# EAGLE schematic Test (EAGLE 7.3.0)
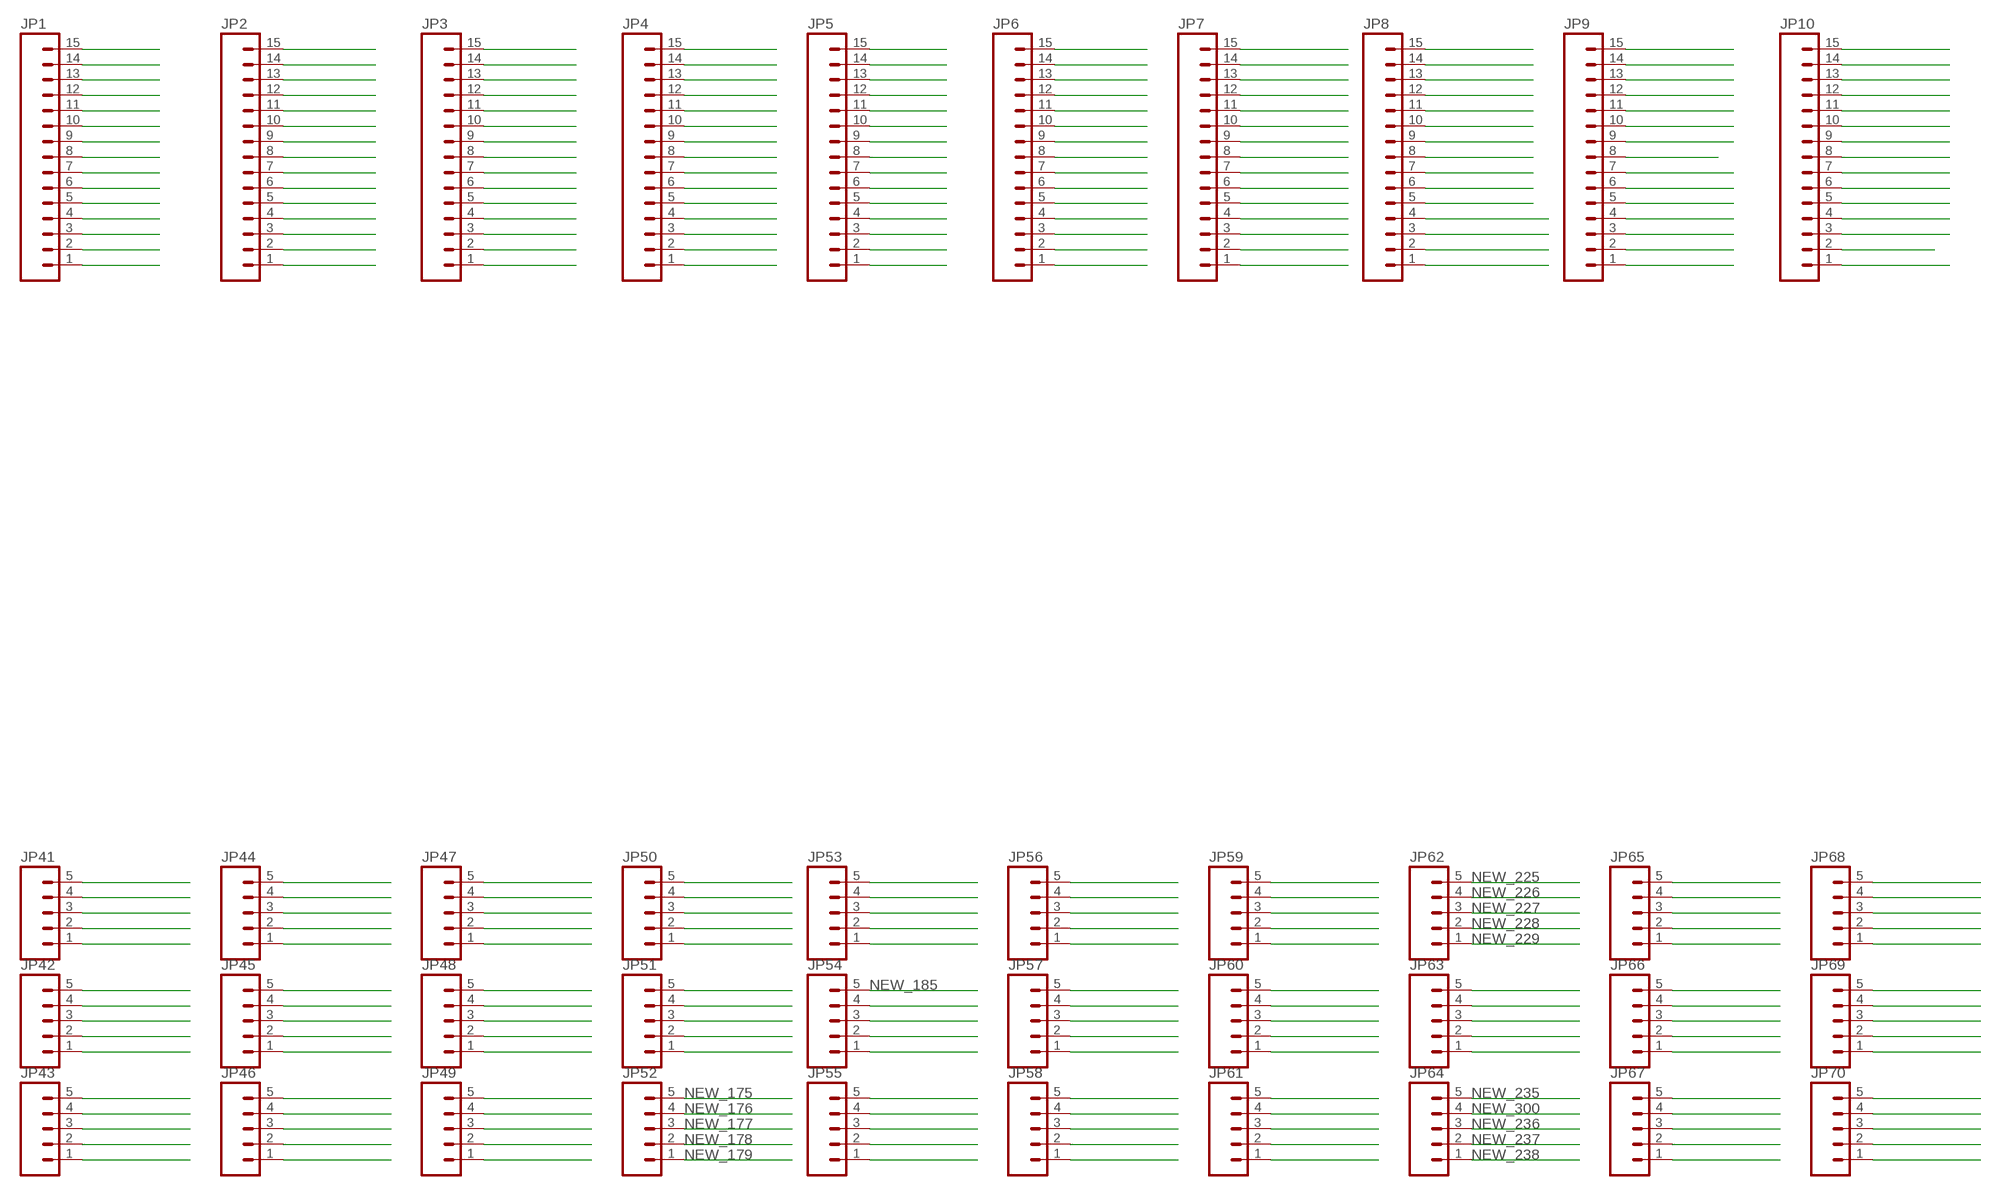
[diagram p0: schematic, sheet 1, part 1 of 2]
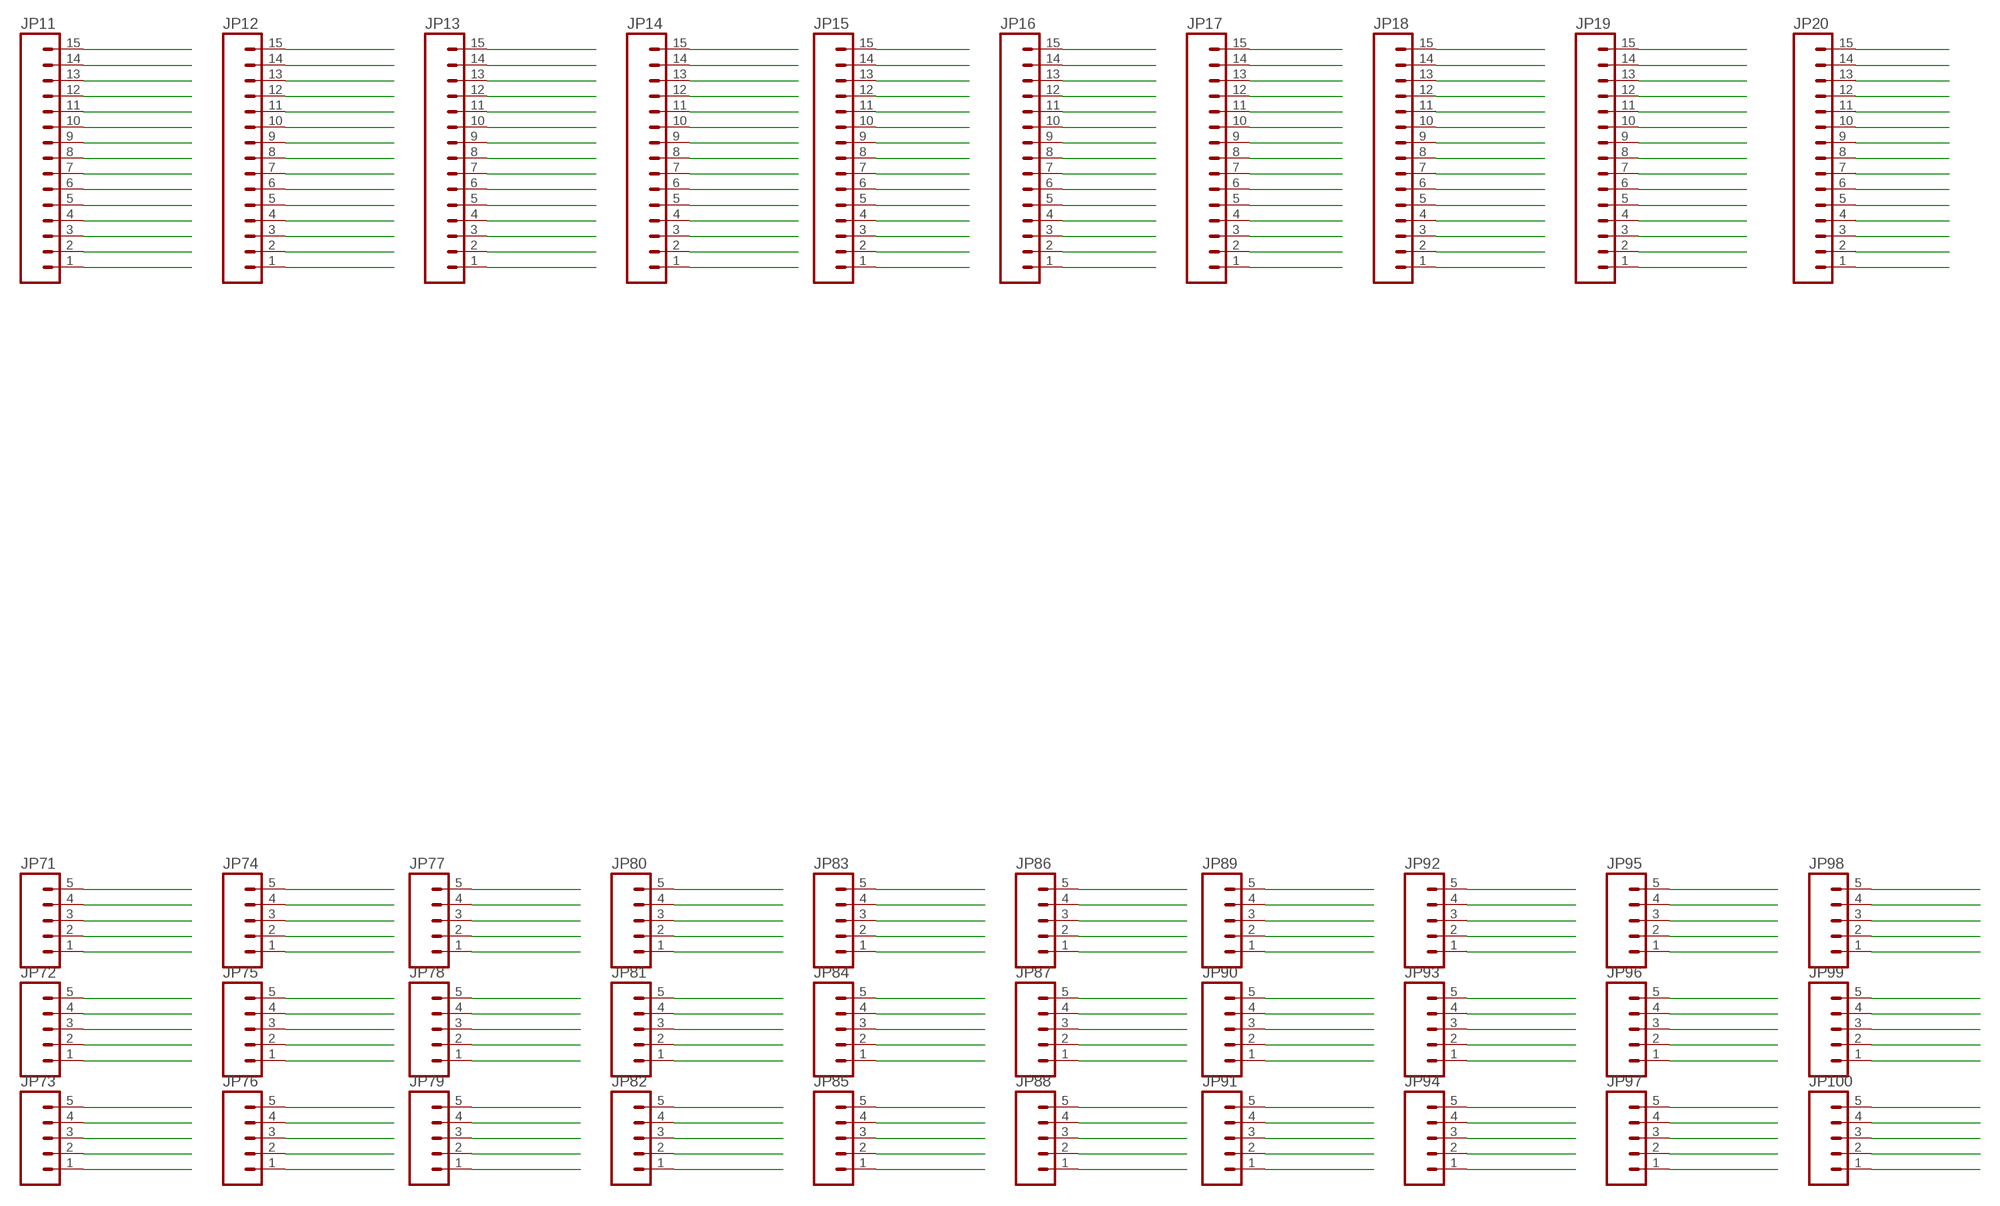
[diagram p1: schematic, sheet 1, part 2 of 2]

## Parts
JP1  M15  [1X15]
JP2  M15  [1X15]
JP3  M15  [1X15]
JP4  M15  [1X15]
JP5  M15  [1X15]
JP6  M15  [1X15]
JP7  M15  [1X15]
JP8  M15  [1X15]
JP9  M15  [1X15]
JP10  M15  [1X15]
JP11  M15  [1X15]
JP12  M15  [1X15]
JP13  M15  [1X15]
JP14  M15  [1X15]
JP15  M15  [1X15]
JP16  M15  [1X15]
JP17  M15  [1X15]
JP18  M15  [1X15]
JP19  M15  [1X15]
JP20  M15  [1X15]
JP41  M051.27MM  [1X05-1.27MM]
JP42  M051.27MM  [1X05-1.27MM]
JP43  M051.27MM  [1X05-1.27MM]
JP44  M051.27MM  [1X05-1.27MM]
JP45  M051.27MM  [1X05-1.27MM]
JP46  M051.27MM  [1X05-1.27MM]
JP47  M051.27MM  [1X05-1.27MM]
JP48  M051.27MM  [1X05-1.27MM]
JP49  M051.27MM  [1X05-1.27MM]
JP50  M051.27MM  [1X05-1.27MM]
JP51  M051.27MM  [1X05-1.27MM]
JP52  M051.27MM  [1X05-1.27MM]
JP53  M051.27MM  [1X05-1.27MM]
JP54  M051.27MM  [1X05-1.27MM]
JP55  M051.27MM  [1X05-1.27MM]
JP56  M051.27MM  [1X05-1.27MM]
JP57  M051.27MM  [1X05-1.27MM]
JP58  M051.27MM  [1X05-1.27MM]
JP59  M051.27MM  [1X05-1.27MM]
JP60  M051.27MM  [1X05-1.27MM]
JP61  M051.27MM  [1X05-1.27MM]
JP62  M051.27MM  [1X05-1.27MM]
JP63  M051.27MM  [1X05-1.27MM]
JP64  M051.27MM  [1X05-1.27MM]
JP65  M051.27MM  [1X05-1.27MM]
JP66  M051.27MM  [1X05-1.27MM]
JP67  M051.27MM  [1X05-1.27MM]
JP68  M051.27MM  [1X05-1.27MM]
JP69  M051.27MM  [1X05-1.27MM]
JP70  M051.27MM  [1X05-1.27MM]
JP71  M051.27MM  [1X05-1.27MM]
JP72  M051.27MM  [1X05-1.27MM]
JP73  M051.27MM  [1X05-1.27MM]
JP74  M051.27MM  [1X05-1.27MM]
JP75  M051.27MM  [1X05-1.27MM]
JP76  M051.27MM  [1X05-1.27MM]
JP77  M051.27MM  [1X05-1.27MM]
JP78  M051.27MM  [1X05-1.27MM]
JP79  M051.27MM  [1X05-1.27MM]
JP80  M051.27MM  [1X05-1.27MM]
JP81  M051.27MM  [1X05-1.27MM]
JP82  M051.27MM  [1X05-1.27MM]
JP83  M051.27MM  [1X05-1.27MM]
JP84  M051.27MM  [1X05-1.27MM]
JP85  M051.27MM  [1X05-1.27MM]
JP86  M051.27MM  [1X05-1.27MM]
JP87  M051.27MM  [1X05-1.27MM]
JP88  M051.27MM  [1X05-1.27MM]
JP89  M051.27MM  [1X05-1.27MM]
JP90  M051.27MM  [1X05-1.27MM]
JP91  M051.27MM  [1X05-1.27MM]
JP92  M051.27MM  [1X05-1.27MM]
JP93  M051.27MM  [1X05-1.27MM]
JP94  M051.27MM  [1X05-1.27MM]
JP95  M051.27MM  [1X05-1.27MM]
JP96  M051.27MM  [1X05-1.27MM]
JP97  M051.27MM  [1X05-1.27MM]
JP98  M051.27MM  [1X05-1.27MM]
JP99  M051.27MM  [1X05-1.27MM]
JP100  M051.27MM  [1X05-1.27MM]

## Nets
NEW_0: JP7.3 JP65.5
NEW_1: JP7.2 JP65.4
NEW_2: JP8.2 JP65.3
NEW_3: JP7.1 JP65.2
NEW_4: JP8.1 JP65.1
NEW_5: JP7.5 JP66.5
NEW_6: JP8.5 JP66.4
NEW_7: JP7.4 JP66.3
NEW_8: JP8.4 JP66.2
NEW_9: JP8.3 JP66.1
NEW_10: JP7.8 JP67.5
NEW_11: JP7.7 JP67.4
NEW_12: JP8.7 JP67.3
NEW_13: JP7.6 JP67.2
NEW_14: JP8.6 JP67.1
NEW_15: JP7.10 JP68.5
NEW_16: JP8.10 JP68.4
NEW_17: JP7.9 JP68.3
NEW_18: JP8.9 JP68.2
NEW_19: JP8.8 JP68.1
NEW_20: JP7.13 JP69.5
NEW_21: JP7.12 JP69.4
NEW_22: JP8.12 JP69.3
NEW_23: JP7.11 JP69.2
NEW_24: JP8.11 JP69.1
NEW_25: JP7.15 JP70.5
NEW_26: JP8.15 JP70.4
NEW_27: JP7.14 JP70.3
NEW_28: JP8.14 JP70.2
NEW_29: JP8.13 JP70.1
NEW_30: JP17.3 JP71.5
NEW_31: JP17.2 JP71.4
NEW_32: JP18.2 JP71.3
NEW_33: JP17.1 JP71.2
NEW_34: JP18.1 JP71.1
NEW_35: JP17.5 JP72.5
NEW_36: JP18.5 JP72.4
NEW_37: JP17.4 JP72.3
NEW_38: JP18.4 JP72.2
NEW_39: JP18.3 JP72.1
NEW_40: JP17.8 JP73.5
NEW_41: JP17.7 JP73.4
NEW_42: JP18.7 JP73.3
NEW_43: JP17.6 JP73.2
NEW_44: JP18.6 JP73.1
NEW_45: JP17.10 JP74.5
NEW_46: JP18.10 JP74.4
NEW_47: JP17.9 JP74.3
NEW_48: JP18.9 JP74.2
NEW_49: JP18.8 JP74.1
NEW_50: JP17.13 JP75.5
NEW_51: JP17.12 JP75.4
NEW_52: JP18.12 JP75.3
NEW_53: JP17.11 JP75.2
NEW_54: JP18.11 JP75.1
NEW_55: JP17.15 JP76.5
NEW_56: JP18.15 JP76.4
NEW_57: JP17.14 JP76.3
NEW_58: JP18.14 JP76.2
NEW_59: JP18.13 JP76.1
NEW_60: JP9.3 JP77.5
NEW_61: JP9.2 JP77.4
NEW_62: JP10.2 JP77.3
NEW_63: JP9.1 JP77.2
NEW_64: JP10.1 JP77.1
NEW_65: JP9.5 JP78.5
NEW_66: JP10.5 JP78.4
NEW_67: JP9.4 JP78.3
NEW_68: JP10.4 JP78.2
NEW_69: JP10.3 JP78.1
NEW_70: JP9.8 JP79.5
NEW_71: JP9.7 JP79.4
NEW_72: JP10.7 JP79.3
NEW_73: JP9.6 JP79.2
NEW_74: JP10.6 JP79.1
NEW_75: JP9.10 JP80.5
NEW_76: JP10.10 JP80.4
NEW_77: JP9.9 JP80.3
NEW_78: JP10.9 JP80.2
NEW_79: JP10.8 JP80.1
NEW_80: JP9.13 JP81.5
NEW_81: JP9.12 JP81.4
NEW_82: JP10.12 JP81.3
NEW_83: JP9.11 JP81.2
NEW_84: JP10.11 JP81.1
NEW_85: JP9.15 JP82.5
NEW_86: JP10.15 JP82.4
NEW_87: JP9.14 JP82.3
NEW_88: JP10.14 JP82.2
NEW_89: JP10.13 JP82.1
NEW_90: JP19.3 JP83.5
NEW_91: JP19.2 JP83.4
NEW_92: JP20.2 JP83.3
NEW_93: JP19.1 JP83.2
NEW_94: JP20.1 JP83.1
NEW_95: JP19.5 JP84.5
NEW_96: JP20.5 JP84.4
NEW_97: JP19.4 JP84.3
NEW_98: JP20.4 JP84.2
NEW_99: JP20.3 JP84.1
NEW_100: JP19.8 JP85.5
NEW_101: JP19.7 JP85.4
NEW_102: JP20.7 JP85.3
NEW_103: JP19.6 JP85.2
NEW_104: JP20.6 JP85.1
NEW_105: JP19.10 JP86.5
NEW_106: JP20.10 JP86.4
NEW_107: JP19.9 JP86.3
NEW_108: JP20.9 JP86.2
NEW_109: JP20.8 JP86.1
NEW_110: JP19.13 JP87.5
NEW_111: JP19.12 JP87.4
NEW_112: JP20.12 JP87.3
NEW_113: JP19.11 JP87.2
NEW_114: JP20.11 JP87.1
NEW_115: JP19.15 JP88.5
NEW_116: JP20.15 JP88.4
NEW_117: JP19.14 JP88.3
NEW_118: JP20.14 JP88.2
NEW_119: JP20.13 JP88.1
NEW_120: JP1.3 JP41.5
NEW_121: JP1.2 JP41.4
NEW_122: JP2.2 JP41.3
NEW_123: JP1.1 JP41.2
NEW_124: JP2.1 JP41.1
NEW_125: JP1.5 JP42.5
NEW_126: JP2.5 JP42.4
NEW_127: JP1.4 JP42.3
NEW_128: JP2.4 JP42.2
NEW_129: JP2.3 JP42.1
NEW_130: JP1.8 JP43.5
NEW_131: JP1.7 JP43.4
NEW_132: JP2.7 JP43.3
NEW_133: JP1.6 JP43.2
NEW_134: JP2.6 JP43.1
NEW_135: JP1.10 JP44.5
NEW_136: JP2.10 JP44.4
NEW_137: JP1.9 JP44.3
NEW_138: JP2.9 JP44.2
NEW_139: JP2.8 JP44.1
NEW_140: JP1.13 JP45.5
NEW_141: JP1.12 JP45.4
NEW_142: JP2.12 JP45.3
NEW_143: JP1.11 JP45.2
NEW_144: JP2.11 JP45.1
NEW_145: JP1.15 JP46.5
NEW_146: JP2.15 JP46.4
NEW_147: JP1.14 JP46.3
NEW_148: JP2.14 JP46.2
NEW_149: JP2.13 JP46.1
NEW_150: JP11.3 JP47.5
NEW_151: JP11.2 JP47.4
NEW_152: JP12.2 JP47.3
NEW_153: JP11.1 JP47.2
NEW_154: JP12.1 JP47.1
NEW_155: JP11.5 JP48.5
NEW_156: JP12.5 JP48.4
NEW_157: JP11.4 JP48.3
NEW_158: JP12.4 JP48.2
NEW_159: JP12.3 JP48.1
NEW_160: JP11.8 JP49.5
NEW_161: JP11.7 JP49.4
NEW_162: JP12.7 JP49.3
NEW_163: JP11.6 JP49.2
NEW_164: JP12.6 JP49.1
NEW_165: JP11.10 JP50.5
NEW_166: JP12.10 JP50.4
NEW_167: JP11.9 JP50.3
NEW_168: JP12.9 JP50.2
NEW_169: JP12.8 JP50.1
NEW_170: JP11.13 JP51.5
NEW_171: JP11.12 JP51.4
NEW_172: JP12.12 JP51.3
NEW_173: JP11.11 JP51.2
NEW_174: JP12.11 JP51.1
NEW_175: JP11.15 JP52.5
NEW_176: JP12.15 JP52.4
NEW_177: JP11.14 JP52.3
NEW_178: JP12.14 JP52.2
NEW_179: JP12.13 JP52.1
NEW_180: JP3.3 JP53.5
NEW_181: JP3.2 JP53.4
NEW_182: JP4.2 JP53.3
NEW_183: JP3.1 JP53.2
NEW_184: JP4.1 JP53.1
NEW_185: JP3.5 JP54.5
NEW_186: JP4.5 JP54.4
NEW_187: JP3.4 JP54.3
NEW_188: JP4.4 JP54.2
NEW_189: JP4.3 JP54.1
NEW_190: JP3.8 JP55.5
NEW_191: JP3.7 JP55.4
NEW_192: JP4.7 JP55.3
NEW_193: JP3.6 JP55.2
NEW_194: JP4.6 JP55.1
NEW_195: JP3.10 JP56.5
NEW_196: JP4.10 JP56.4
NEW_197: JP3.9 JP56.3
NEW_198: JP4.9 JP56.2
NEW_199: JP4.8 JP56.1
NEW_200: JP3.13 JP57.5
NEW_201: JP3.12 JP57.4
NEW_202: JP4.12 JP57.3
NEW_203: JP3.11 JP57.2
NEW_204: JP4.11 JP57.1
NEW_205: JP3.15 JP58.5
NEW_206: JP4.15 JP58.4
NEW_207: JP3.14 JP58.3
NEW_208: JP4.14 JP58.2
NEW_209: JP4.13 JP58.1
NEW_210: JP13.3 JP59.5
NEW_211: JP13.2 JP59.4
NEW_212: JP14.2 JP59.3
NEW_213: JP13.1 JP59.2
NEW_214: JP14.1 JP59.1
NEW_215: JP13.5 JP60.5
NEW_216: JP14.5 JP60.4
NEW_217: JP13.4 JP60.3
NEW_218: JP14.4 JP60.2
NEW_219: JP14.3 JP60.1
NEW_220: JP13.8 JP61.5
NEW_221: JP13.7 JP61.4
NEW_222: JP14.7 JP61.3
NEW_223: JP13.6 JP61.2
NEW_224: JP14.6 JP61.1
NEW_225: JP13.10 JP62.5
NEW_226: JP14.10 JP62.4
NEW_227: JP13.9 JP62.3
NEW_228: JP14.9 JP62.2
NEW_229: JP14.8 JP62.1
NEW_230: JP13.13 JP63.5
NEW_231: JP13.12 JP63.4
NEW_232: JP14.12 JP63.3
NEW_233: JP13.11 JP63.2
NEW_234: JP14.11 JP63.1
NEW_235: JP14.15 JP64.5
NEW_236: JP13.14 JP64.3
NEW_237: JP14.14 JP64.2
NEW_238: JP14.13 JP64.1
NEW_239: JP5.5 JP89.5
NEW_240: JP5.4 JP89.4
NEW_241: JP5.3 JP89.3
NEW_242: JP5.2 JP89.2
NEW_243: JP5.1 JP89.1
NEW_244: JP5.10 JP90.5
NEW_245: JP5.9 JP90.4
NEW_246: JP5.8 JP90.3
NEW_247: JP5.7 JP90.2
NEW_248: JP5.6 JP90.1
NEW_249: JP5.15 JP91.5
NEW_250: JP5.14 JP91.4
NEW_251: JP5.13 JP91.3
NEW_252: JP5.12 JP91.2
NEW_253: JP5.11 JP91.1
NEW_254: JP15.5 JP92.5
NEW_255: JP15.4 JP92.4
NEW_256: JP15.3 JP92.3
NEW_257: JP15.2 JP92.2
NEW_258: JP15.1 JP92.1
NEW_259: JP15.11 JP97.5
NEW_260: JP15.12 JP97.4
NEW_261: JP15.13 JP97.3
NEW_262: JP15.14 JP97.2
NEW_263: JP15.15 JP97.1
NEW_264: JP15.6 JP98.5
NEW_265: JP15.7 JP98.4
NEW_266: JP15.8 JP98.3
NEW_267: JP15.9 JP98.2
NEW_268: JP15.10 JP98.1
NEW_269: JP16.1 JP93.5
NEW_270: JP16.2 JP93.4
NEW_271: JP16.3 JP93.3
NEW_272: JP16.4 JP93.2
NEW_273: JP16.5 JP93.1
NEW_274: JP6.11 JP94.5
NEW_275: JP6.12 JP94.4
NEW_276: JP6.13 JP94.3
NEW_277: JP6.14 JP94.2
NEW_278: JP6.15 JP94.1
NEW_279: JP6.6 JP95.5
NEW_280: JP6.7 JP95.4
NEW_281: JP6.8 JP95.3
NEW_282: JP6.9 JP95.2
NEW_283: JP6.10 JP95.1
NEW_284: JP6.1 JP96.5
NEW_285: JP6.2 JP96.4
NEW_286: JP6.3 JP96.3
NEW_287: JP6.4 JP96.2
NEW_288: JP6.5 JP96.1
NEW_289: JP16.10 JP99.5
NEW_290: JP16.9 JP99.4
NEW_291: JP16.8 JP99.3
NEW_292: JP16.7 JP99.2
NEW_293: JP16.6 JP99.1
NEW_294: JP16.15 JP100.5
NEW_295: JP16.14 JP100.4
NEW_296: JP16.13 JP100.3
NEW_297: JP16.12 JP100.2
NEW_298: JP16.11 JP100.1
NEW_300: JP13.15 JP64.4

## Library data of the parts
JP1-JP20 = SparkFun-Connectors:M15: Header 15 Standard 15-pin 0.1" header. Use with straight break away headers (SKU : PRT-00116), right angle break away headers (PRT-00553), swiss pins (PRT-00743), machine pins (PRT-00117), and female headers (PRT-00115).
JP41-JP100 = SparkFun-Connectors:M05: Header 5 Standard 5-pin 0.1" header. Use with straight break away headers (SKU : PRT-00116), right angle break away headers (PRT-00553), swiss pins (PRT-00743), machine pins (PRT-00117), and female headers (PRT-00115). Molex polarized connector foot print use with SKU : PRT-08230 with associated crimp pins and housings.